# EAGLE schematic usb-led (EAGLE 7.4.0)
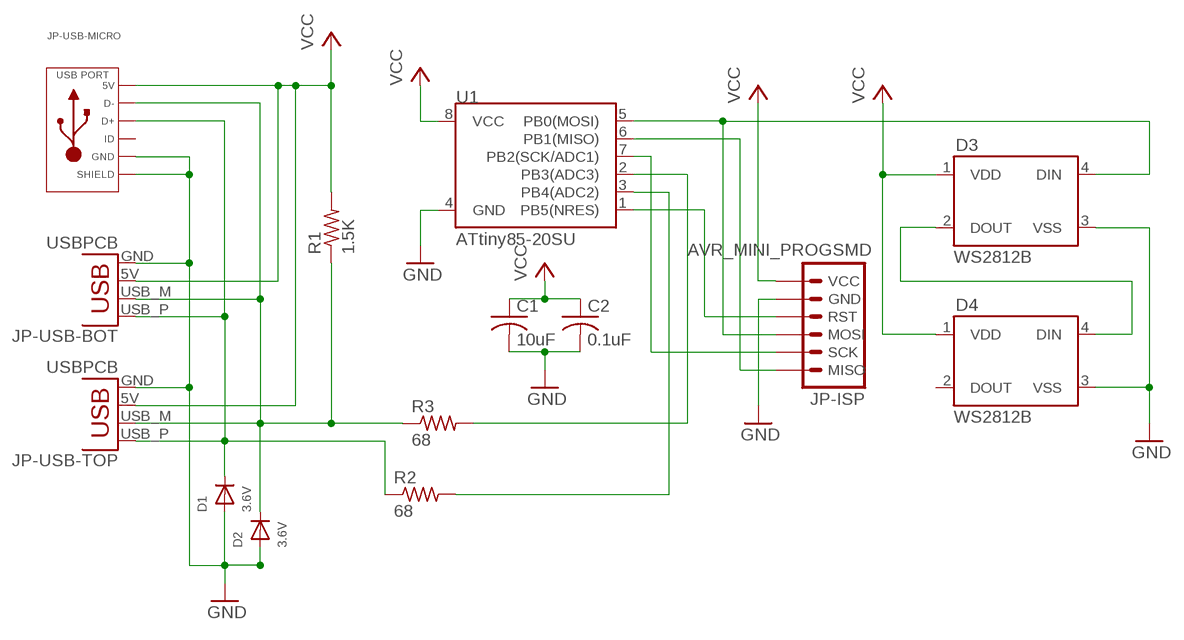
[diagram p0: schematic, sheet 1]

## Parts
C1  10uF  C-USC0402  [C0402]
C2  0.1uF  C-USC0402  [C0402]
D1  3.6V  DIODESOD-523  [SOD-523]
D2  3.6V  DIODESOD-523  [SOD-523]
D3  WS2812B  [WS2812B]
D4  WS2812B  [WS2812B]
JP-ISP  AVR_MINI_PROGSMD  [AVR_MINI_PROG]
JP-USB-BOT  USBPCB  [USB-A-PCB]
JP-USB-MICRO  USB_MICRO_RIGHT  [MICROUSB-RIGHT]
JP-USB-TOP  USBPCB  [USB-A-PCB]
R1  1.5K  R-US_R0402  [R0402]
R2  68  R-US_R0402  [R0402]
R3  68  R-US_R0402  [R0402]
U1  ATtiny85-20SU  ATTINY45TINY85-20-SMT  [SO08-EIAJ]

## Nets
DIN_2: D3.2(DOUT) D4.4(DIN)
GND: C1.2 C2.2 D1.A D2.A D3.3(VSS) D4.3(VSS) JP-ISP.2(GND) JP-USB-BOT.GND JP-USB-MICRO.5(GND) JP-USB-MICRO.S1(SLD) JP-USB-MICRO.S2(SLD) JP-USB-MICRO.S3(SLD) JP-USB-MICRO.S4(SLD) JP-USB-MICRO.S5(SLD) JP-USB-MICRO.S6(SLD) JP-USB-TOP.GND U1.4(GND)
MISO: JP-ISP.6(MISO) U1.6(PB1(MISO))
MOSI/DIN: D3.4(DIN) JP-ISP.4(MOSI) U1.5(PB0(MOSI))
RESET: JP-ISP.3(RST) U1.1(PB5(NRES))
SCK: JP-ISP.5(SCK) U1.7(PB2(SCK/ADC1))
USB_D_MINUS: R3.2 U1.2(PB3(ADC3))
USB_D_MINUS_RAW: D2.K(C) JP-USB-BOT.USB_M(D-) JP-USB-MICRO.2(D-) JP-USB-TOP.USB_M(D-) R1.1 R3.1
USB_D_PLUS: R2.2 U1.3(PB4(ADC2))
USB_D_PLUS_RAW: D1.K(C) JP-USB-BOT.USB_P(D+) JP-USB-MICRO.3(D+) JP-USB-TOP.USB_P(D+) R2.1
VCC: C1.1 C2.1 D3.1(VDD) D4.1(VDD) JP-ISP.1(VCC) JP-USB-BOT.5V(VBUS) JP-USB-MICRO.1(5V) JP-USB-TOP.5V(VBUS) R1.2 U1.8(VCC)
Unconnected: D4.2(DOUT) JP-USB-MICRO.4(ID)

## Library data of the parts
C1 C2 = rcl:C-US: CAPACITOR, American symbol
D1 D2 = microbuilder:DIODE: Diode SMA Model Volts Amps Type Vf Vr Digikey # Notes SSA34-E3 40V 3A Schottky 480mV @ 3A 200uA @ 40V SSA34-E3/61TGITR-ND CDBA120-G 20V 1A Schottky 500mV @ 1A 500uA @ 20V 641-1014-6-ND REEL MBRA210 10V 2A Schottky 350mV @ 2A 700uA @ 10V MBRA210LT3 SOD-123 Model Volts Amps Type Vf Vr Order # Notes BAT54T1G 30V 200mA Schottky 800mV @ 200mA 2uA @ 25V BAT54T1GOSTR-ND B0530W 30V 500mA Schottky 430mV @ 500mA 130uA @ 30V B0530W-FDICT-ND REEL MBR120 1A 20V Schottky 340mV @ 1A MBR120VLSFT1GOSCT-ND SOD-323 Model Volts Amps Type Vf Vr Order # Notes PMEG2005EJ 20V 500mA Schottky 355mV @ 500mA 568-4110-1-ND ZLLS410 10V 570mA Schottky 380mV @ 570mA ZLLS410CT-ND 1N4148WS 75V 150mA Silicon/Simple 1V 1N4148WSFSCT-ND REEL SOD-523 Model Volts Amps Type Vf Vr Order # Notes BAT54XV2 30V 200mA Schottky 0.8V @ 100mA BAT54XV2CT-ND TB751S 30V 30mA Schottky RB751S-40TE61CT-ND SOT23-R/W (R = Solder Paste/Reflow Ovens, W = Hand-Soldering) Model Volts Amps Type Vf Vr Order # Notes BAT54FILM 40V 300mA Schottky 497-7162-1-ND
D3 D4 = SparkFun-LED:WS2812B: WS2812B - Intelligent control LED integrated light source Technical Specifications: Power Supply Voltage (VDD): 3.5 to 5.3 V Input Voltage (VI): -0.5 to VDD+0.5 V Operating Junction Temperature (Topt): -25°C to +80°C Storage Temperature Range (Tstg): -55°C to +150°C; PROD_ID: DIO-12503
JP-ISP = SparkFun-Connectors:AVR_MINI_PROG: AVR ISP 6-pin inline header
JP-USB-BOT JP-USB-TOP = SparkFun-Connectors:USB: USB Connectors USB-B-PTH is fully proven SKU : PRT-00139/CONN-08278 USB-miniB is fully proven SKU : PRT-00587 USB-A-PCB is untested. USB-A-H is throughly reviewed, but untested. Spark Fun Electronics SKU : PRT-00437 USB-B-SMT is throughly reviewed, but untested. Needs silkscreen touching up. USB-A-S has not been used/tested USB-MB-H has not been used/tested USB-MICROB has been used. CONN-09505
JP-USB-MICRO = MF_Connectors:USB: Library: MF_Connectors Description: 5 Pin USB Connectors. SLD is the shield connection. Usually tied to ground through a small ferrite bead.
R1-R3 = rcl:R-US_: RESISTOR, American symbol
U1 = SparkFun-DigitalIC:ATTINY45: Atmel 8-pin 2/4/8kB flash uC; PROD_ID: IC-09092; VALUE: Tiny85-20-SMT